# Altium project TPTCM_WiFi_Bridge.PrjPcb
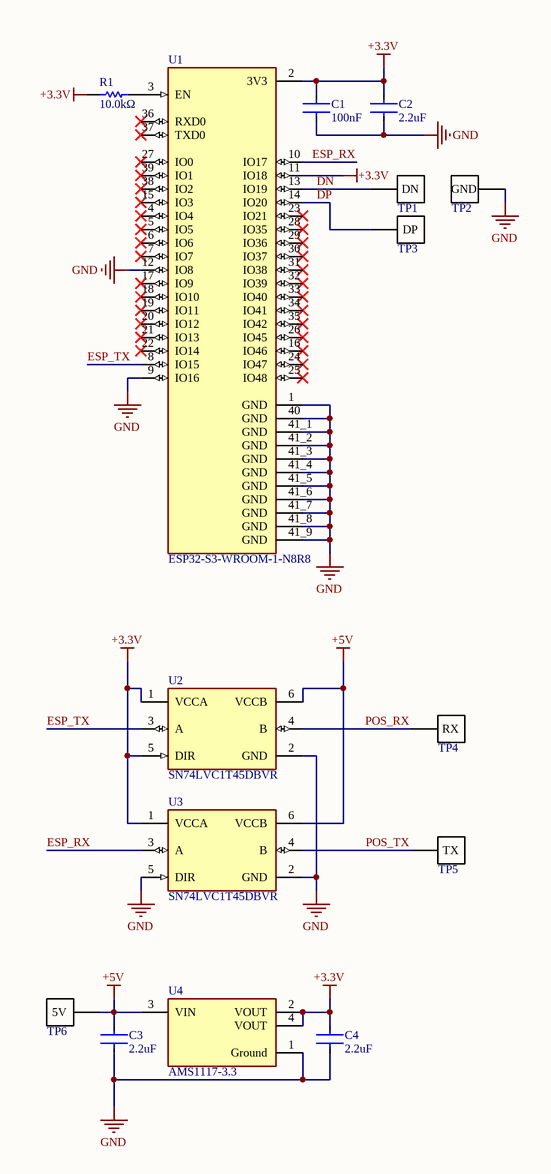
[diagram p0: Bridge.SchDoc]
1 sheet, 15 parts. Net scope: global (net labels, ports and power ports of the same name join across sheets).
Board file: Bridge.PcbDoc

## Sheet Bridge.SchDoc
size A4 portrait; SheetNumber: 1; SheetTotal: 1

### Parts
C1  100nF  [FP-GRM0603-MFG]
C2  2.2uF  [FP-GRM0603-MFG]
C3  2.2uF  [FP-GRM0603-MFG]
C4  2.2uF  [FP-GRM0603-MFG]
R1  10.0kΩ  [FP-CRCW0603-E3-MFG]
TP1  DN  [FP-Testpoint]  (value not drawn)  (no BOM)
TP2  GND  [FP-Testpoint]  (value not drawn)  (no BOM)
TP3  DP  [FP-Testpoint]  (value not drawn)  (no BOM)
TP4  RX  [FP-Testpoint]  (value not drawn)  (no BOM)
TP5  TX  [FP-Testpoint]  (value not drawn)  (no BOM)
TP6  5V  [FP-Testpoint]  (value not drawn)  (no BOM)
U1  ESP32-S3-WROOM-1-N8R8  [XCVR_ESP32S3WROOM1N8R8]
U2  SN74LVC1T45DBVR  [FP-DBV0006A-IPC_C]
U3  SN74LVC1T45DBVR  [FP-DBV0006A-IPC_C]
U4  AMS1117-3.3  [FP-AMS1117-IPC_C]

### Nets
+3.3V: C1.1 C2.1 C4.1 R1.2 U1.2(3V3) U1.11(IO18) U2.1(VCCA) U2.5(DIR) U3.1(VCCA) U4.2(VOUT) U4.4(VOUT)
+5V: C3.1 TP6.1 U2.6(VCCB) U3.6(VCCB) U4.3(VIN)
GND: C1.2 C2.2 C3.2 C4.2 TP2.1 U1.1(GND) U1.9(IO16) U1.12(IO8) U1.40(GND) U1.41_1(GND) U1.41_2(GND) U1.41_3(GND) U1.41_4(GND) U1.41_5(GND) U1.41_6(GND) U1.41_7(GND) U1.41_8(GND) U1.41_9(GND) U2.2(GND) U3.2(GND) U3.5(DIR) U4.1(Ground)
DN: TP1.1 U1.13(IO19)
DP: TP3.1 U1.14(IO20)
ESP_RX: U1.10(IO17) U3.3(A)
ESP_TX: U1.8(IO15) U2.3(A)
POS_RX: TP4.1 U2.4(B)
POS_TX: TP5.1 U3.4(B)
NetR1_1: R1.1 U1.3(EN)

Not connected (* = marked no-connect by the designer): U1 4(IO4)* 5(IO5)* 6(IO6)* 7(IO7)* 15(IO3)* 16(IO46)* 17(IO9)* 18(IO10)* 19(IO11)* 20(IO12)* 21(IO13)* 22(IO14)* 23(IO21)* 24(IO47)* 25(IO48)* 26(IO45)* 27(IO0)* 28(IO35)* 29(IO36)* 30(IO37)* 31(IO38)* 32(IO39)* 33(IO40)* 34(IO41)* 35(IO42)* 36(RXD0)* 37(TXD0)* 38(IO2)* 39(IO1)*

### Library data of the parts
C1 = GRM188R71E104KA01D: Cap 100nF 25V X7R 0603 ±10%; Manufacturer: Murata; Capacitance(pF): 100000; Temperature Coefficient: ±15%; Spec Code: A01; Part Number: GRM188R71E104KA01D; Value: 100nF; Series: GRM; Capacitance: 100nF; Tolerance: ±10%; Dielectric Type: X7R; Maximum Voltage: 25V; Size Code: 0603; Dimensions: 1.6x0.8mm; Thickness: 0.8mm; Temperature Range: -55 to 125°C; Packaging: D
C2-C4 = GRM188R71A225KE15D: Cap 2.2uF 10V X7R 0603 ±10%; Manufacturer: Murata; Capacitance(pF): 2200000; Temperature Coefficient: ±15%; Spec Code: E15; Part Number: GRM188R71A225KE15D; Value: 2.2uF; Series: GRM; Capacitance: 2.2uF; Tolerance: ±10%; Dielectric Type: X7R; Maximum Voltage: 10V; Size Code: 0603; Dimensions: 1.6x0.8mm; Thickness: 0.8mm; Temperature Range: -55 to 125°C; Packaging: D
R1 = CRCW060310K0JN: Resistor 10.0kΩ ±5% 0603 ±200 ppm/K; Manufacturer: Vishay; Metric Size: RR1608M; Resistance(Ohms): 10000; Resistance Code: 10K0; Tolerance Code: J; TCR Code: N; Power @ 70°C: 0.1W; Max Voltage: 75V; Packaging Codes: EA, EB, EC, ED, EE, EI, EL; Packaging Info: ET1 (5000pcs); ET5 (10000pcs); ET6 (20000pcs); ET7 (10000pcs); EF4 (50000pcs); ET2 (5000pcs); ET4 (20000pcs); Quantities: 5000, 10000, 20000, 10000, 50000, 5000, 20000; Reel Sizes: 285mm, 330mm, 180mm; Jumper: No; Part Number: CRCW060310K0JN; Value: 10.0kΩ; Series: D/CRCW e3; Size: 0603; Resistance: 10.0kΩ; Tolerance: ±5%; TCR: ±200 ppm/K; Tape Pitches: 2mm, 4mm; Jumper Current: -
TP1-TP6 = Testpoint
U1 = ESP32-S3-WROOM-1-N8R8: Bluetooth, WiFi 802.11b/g/n, Bluetooth v5.0 Transceiver Module 2.4GHz PCB Trace Surface Mount; MF: Espressif Systems; Package: None; Price: None; Check_prices: https://www.snapeda.com/parts/ESP32-S3-WROOM-1-N8R8/Espressif+Systems/view-part/?ref=eda; Value: *; SnapEDA_Link: https://www.snapeda.com/parts/ESP32-S3-WROOM-1-N8R8/Espressif+Systems/view-part/?ref=snap; MP: ESP32-S3-WROOM-1-N8R8; Availability: In Stock; Purchase-URL: https://pricing.snapeda.com/search?q=ESP32-S3-WROOM-1-N8R8&ref=eda
U2 U3 = CMP-0859-00206-4: IC TRNSLTR BIDIRECTIONAL SOT23-6; Number of Inputs: 1; Logic Function: Translator; Min Supply Voltage: 1.65V; Quiescent Current: 3uA; Turn-On Delay Time: 36.2ns; Max Supply Voltage: 5.5V; Polarity: Non-Inverting; Propagation Delay: 3.9ns; Low Level Output Current: 32mA; Data Rate: 420Mbps; High Level Output Current: -32mA; Number of Bits: 1; Max Operating Temperature: 85°C; Mount: Surface Mount; Lead Free: Lead Free; Number of Elements: 1; Package Quantity: 3000; Number of Pins: 6; Width: 1.3mm; Min Operating Temperature: -40°C; REACH SVHC: No SVHC; Weight: 0.000229oz; Contact Plating: Gold; Height: 1.75mm; Direction: Bidirectional; Number of Channels: 1; Length: 3.05mm; Packaging: Tape and Reel; Radiation Hardening: No; Case/Package: SOT-23
U4 = CMP-209535-000001-1: LDO Voltage Regulators 1A, 3.3V; Manufacturer: Advanced Monolithic Systems; Dropout Voltage: 1.1V; Output Type: Fixed; Nominal Supply Current: 5mA; Max Power Dissipation: 1.2W; Max Supply Voltage: 15V; Number Of Outputs: 1; Standoff Height: 0.64mm; Max Junction Temp: +125°C; Height: 1.8mm; Package: AMS1117; Device Class L2: Power Management ICs; ComponentLink2Description: Datasheet; ComponentLink2URL: http://www.advanced-monolithic.com/pdf/ds1117.pdf; Category: IC; RoHS: TRUE; Automotive: No; Device Class L1: Integrated Circuits (ICs); Output Current: 1A; Device Class L3: Voltage Regulators - Linear; Temperature: -40°C to +125°C; Output Voltage: 3.3V; Manufacturer Part Number: AMS1117-3.3; Temperature Range Low: -40°C; Octopart: https://octopart.com/ams1117-3.3-advanced+monolithic+systems-25899300; Lead Free: Yes; Ipc Land Pattern Name: SOT229P700X180-4; Temperature Range High: +125°C